# EAGLE schematic 702_universal_i2c (EAGLE 7.4.0)
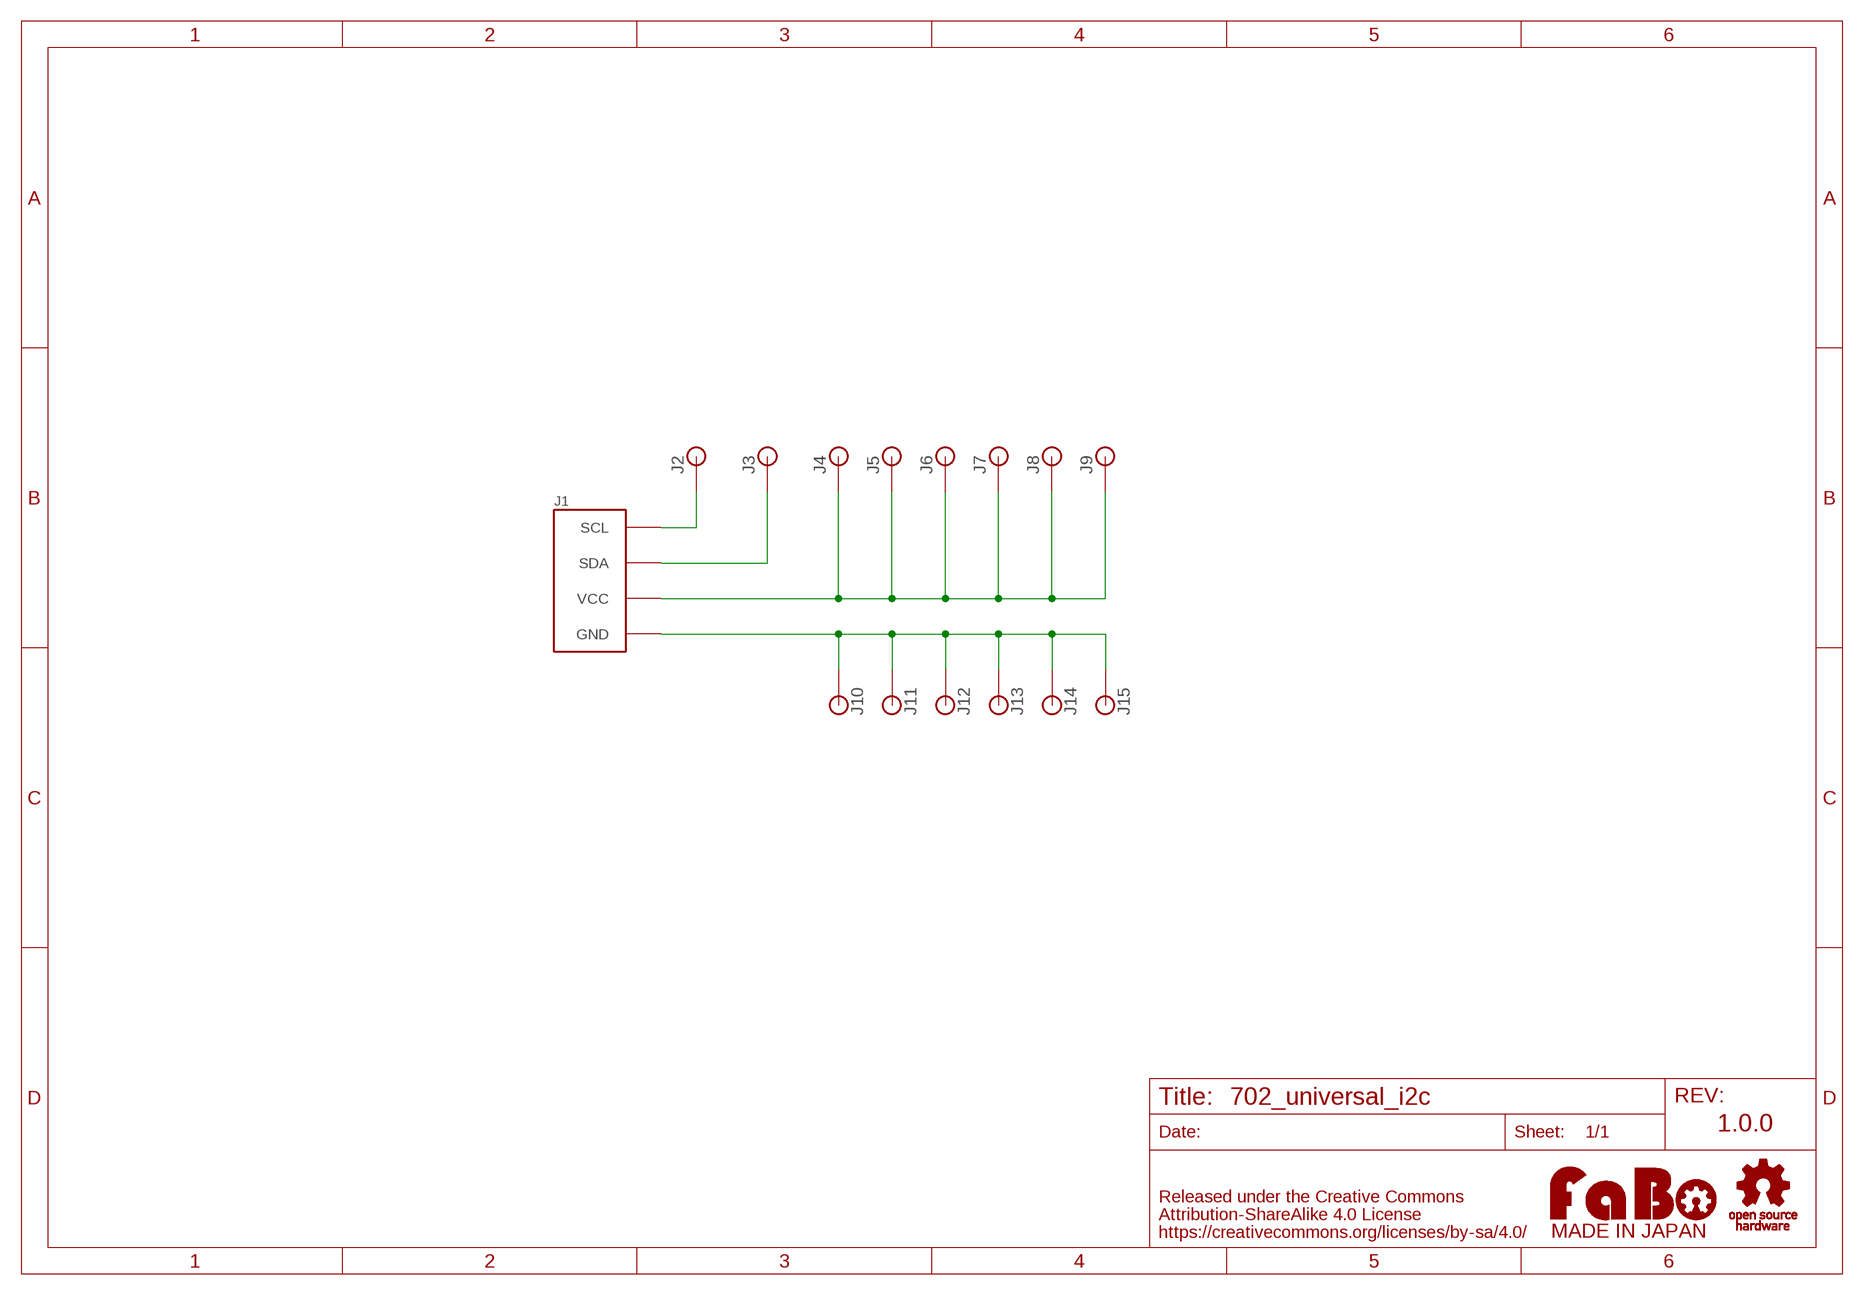
[diagram p0: schematic, sheet 1]

## Parts
J1  FABO_BRICK_I2C-UNIVERSAL  [FABO_BRICK_I2C_UNIVERSAL]
J2  PINHEAD_1X1-NONAME  [PIN_1X1_NONAME]
J3  PINHEAD_1X1-NONAME  [PIN_1X1_NONAME]
J4  PINHEAD_1X1-NONAME  [PIN_1X1_NONAME]
J5  PINHEAD_1X1-NONAME  [PIN_1X1_NONAME]
J6  PINHEAD_1X1-NONAME  [PIN_1X1_NONAME]
J7  PINHEAD_1X1-NONAME  [PIN_1X1_NONAME]
J8  PINHEAD_1X1-NONAME  [PIN_1X1_NONAME]
J9  PINHEAD_1X1-NONAME  [PIN_1X1_NONAME]
J10  PINHEAD_1X1-NONAME  [PIN_1X1_NONAME]
J11  PINHEAD_1X1-NONAME  [PIN_1X1_NONAME]
J12  PINHEAD_1X1-NONAME  [PIN_1X1_NONAME]
J13  PINHEAD_1X1-NONAME  [PIN_1X1_NONAME]
J14  PINHEAD_1X1-NONAME  [PIN_1X1_NONAME]
J15  PINHEAD_1X1-NONAME  [PIN_1X1_NONAME]
U$16  LOGO_OSHW-S_BOTTOM  [LOGO_OSHW_S_BOTTOM]
U$17  LOGO_FABO-M_BOTTOM  [LOGO_FABO_M_BOTTOM]

## Nets
GND: J1.GND J10.1 J11.1 J12.1 J13.1 J14.1 J15.1
SCL: J1.SCL J2.1
SDA: J1.SDA J3.1
VCC: J1.VCC J4.1 J5.1 J6.1 J7.1 J8.1 J9.1

## Notes on the sheet
- 1.0.0

## Library data of the parts
J1 = FaBo-Template:FABO_BRICK_I2C: FaBo Brick I2C
J2-J15 = FaBo-etc:PINHEAD_1X1
U$16 = FaBo-etc:LOGO_OSHW
U$17 = FaBo-etc:LOGO_FABO

## Net classes
0 default: width 0.254 mm